# Altium project BS.PrjPCB
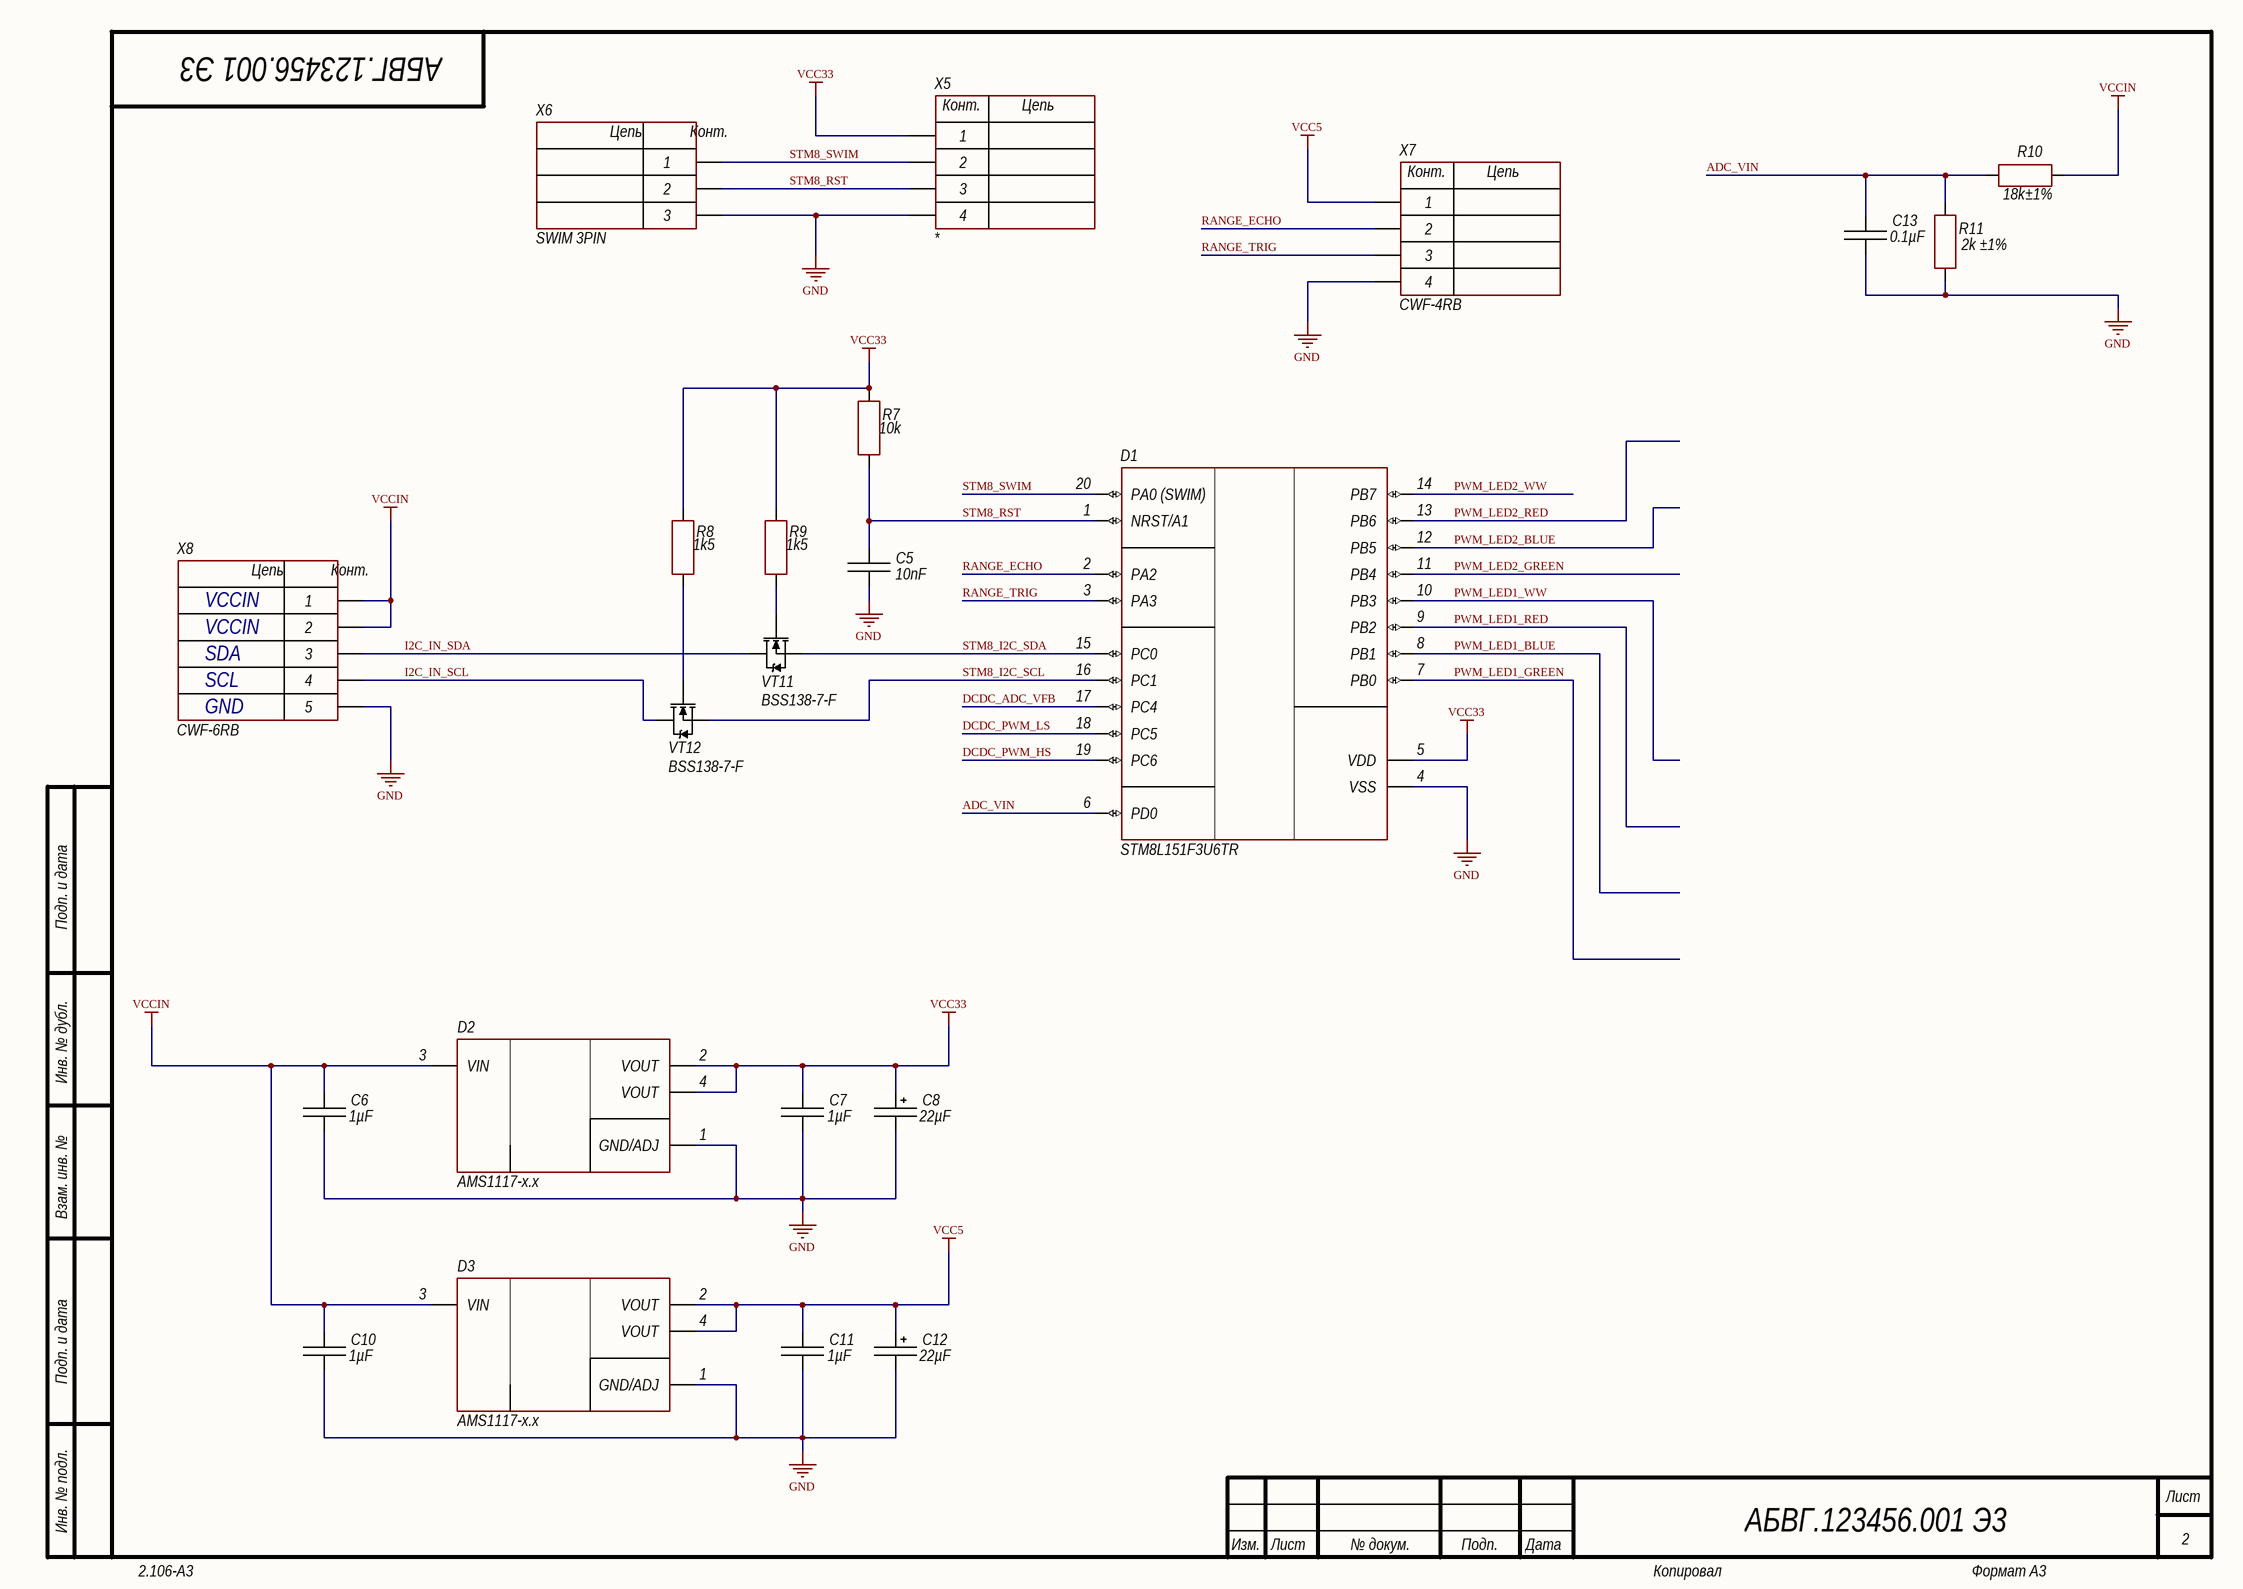
[diagram p0: MCU.SchDoc]
3 sheets, 57 parts. Net scope: global (net labels, ports and power ports of the same name join across sheets).
Board file: PCB.PcbDoc
Sheets:
  MCU.SchDoc
  DC unit.SchDoc
  LED Connection.SchDoc

## Sheet MCU.SchDoc
size 420 x 297 mm; Address1: Address1; Address2: Address2; Address3: Address3; Address4: Address4; DocumentNumber: АБВГ.123456.001 Э3; SheetNumber: 2; Scale: 1:1; DocumentType: Схема электрическая принципиальная; FirstReferrence: АБВГ.123456.001

### Parts
C5  10nF  [CH0603C]
C6  1µF  [CH0603C]
C7  1µF  [CH0603C]
C8  22µF  [TANTAL_B]
C10  1µF  [CH0603C]
C11  1µF  [CH0603C]
C12  22µF  [TANTAL_B]
C13  0.1µF  [CH0603C]
D1  STM8L151F3U6TR  [20-UFQFPN]
D2  AMS1117-x.x  [SOT223]
D3  AMS1117-x.x  [SOT223]
R7  10k  [CH0603R]
R8  1k5  [CH0603R]
R9  1k5  [CH0603R]
R10  18k  ComponentKind: ±1%  [CH0603R]
R11  2k  ComponentKind: ±1%  [CH0603R]
VT11  BSS138-7-F  [SOT23_132]
VT12  BSS138-7-F  [SOT23_132]
X5  *  [CON: CWF-4RB]
X6  SWIM 3PIN  [CON: 3 PIN 1x1]
X7  CWF-4RB  [CON: CWF-4RB]
X8  CWF-6RB  [CON: CWF-5RB]

### Nets
GND: C5.1 C6.1 C7.1 C8.2 C10.1 C11.1 C12.2 C13.2 D1.4(VSS) D2.1(GND/ADJ) D3.1(GND/ADJ) R11.1 X5.4 X6.3 X7.4 X8.5
VCC5: C11.2 C12.1 D3.2(VOUT) D3.4(VOUT) X7.1
VCC33: C7.2 C8.1 D1.5(VDD) D2.2(VOUT) D2.4(VOUT) R7.2 R8.2 R9.2 X5.1
VCCIN: C6.2 C10.2 D2.3(VIN) D3.3(VIN) R10.2 X8.1 X8.2
ADC_VIN: C13.1 D1.6(PD0) R10.1 R11.2
DCDC_ADC_VFB: D1.17(PC4)
DCDC_PWM_HS: D1.19(PC6)
DCDC_PWM_LS: D1.18(PC5)
I2C_IN_SCL: VT12.2(D) X8.4
I2C_IN_SDA: VT11.2(D) X8.3
PWM_LED1_BLUE: D1.8(PB1)
PWM_LED1_GREEN: D1.7(PB0)
PWM_LED1_RED: D1.9(PB2)
PWM_LED1_WW: D1.10(PB3)
PWM_LED2_BLUE: D1.12(PB5)
PWM_LED2_GREEN: D1.11(PB4)
PWM_LED2_RED: D1.13(PB6)
PWM_LED2_WW: D1.14(PB7)
RANGE_ECHO: D1.2(PA2) X7.2
RANGE_TRIG: D1.3(PA3) X7.3
STM8_I2C_SCL: D1.16(PC1) VT12.3(S)
STM8_I2C_SDA: D1.15(PC0) VT11.3(S)
STM8_RST: C5.2 D1.1(NRST/A1) R7.1 X5.3 X6.2
STM8_SWIM: D1.20(PA0_(SWIM)) X5.2 X6.1
NetR8_1: R8.1 VT12.1(G)
NetR9_1: R9.1 VT11.1(G)

### Notes on the sheet
- VCCIN
- SDA
- SCL
- GND
- Подп. и дата
- Инв. № дубл.
- Взам. инв. №
- Инв. № подл.
- Изм.
- Лист
- № докум.
- Подп.
- Дата
- 2.106-A3
- Копировал
- Формат А3
- (in symbol 3-Connector) Цепь; Конт.
- (in symbol 5-Connector) Цепь; Конт.

### Library data of the parts
C5 C13 = Capacitor: Manufacturer: *; Model: *; HelpURL: *; ComponentKind: *
  C5: Value: 10nF
  C13: Value: 0.1µF
C6 C7 C10 C11 = Capacitor: Manufacturer: Murata Electronics Inc.; Model: GRM188R71C105KE15D; HelpURL: https://www.terraelectronica.ru/product/2094261; ComponentKind: X5R; Value: 1µF
C8 C12 = TantalCap: Manufacturer: *; Model: *; HelpURL: *; ComponentKind: *; Value: 22µF
D1 = STM8L151F3U6TR: STM8; Manufacturer: ST Microelectronics; Model: STM8L151F3U6TR; ComponentKind: UFQFPN20; HelpURL: https://ru.mouser.com/ProductDetail/STMicroelectronics/STM8L151F3U6TR?qs=%2fha2pyFadujNatApb6mgzz%2fJ8pBCuKMdXUiFB4BdrxFB7btRjiLFjw%3d%3d
D2 D3 = AMS1117-x.x: Step-down; Manufacturer: Advanced Monolithic Systems; Model: AMS11117-X.X; HelpURL: http://www.advanced-monolithic.com/pdf/ds1117.pdf; ComponentKind: SOT-223
R7-R11 = Resistor: Manufacturer: *; Model: *; HelpURL: *
  R7: ComponentKind: *; Value: 10k
  R8 R9: ComponentKind: *; Value: 1k5
  R10: Value: 18k
  R11: Value: 2k
VT11 VT12 = N-chanel: Mosfet; Manufacturer: Diodes Incorporated; Model: BSS138-7-F; ComponentKind: 0.2А, 50В; HelpURL: https://static.chipdip.ru/lib/333/DOC003333982.pdf
X5 X7 = 4-Connector: Manufacturer: *; HelpURL: *; ComponentKind: *
  X5: Model: *
  X7: Model: CWF-4RB
X6 = 3-Connector: Model: SWIM 3PIN; Manufacturer: *; HelpURL: *; ComponentKind: *
X8 = 5-Connector: Model: CWF-6RB; Manufacturer: *; HelpURL: *; ComponentKind: *

## Sheet DC unit.SchDoc
size 420 x 297 mm; Address1: Address1; Address2: Address2; Address3: Address3; Address4: Address4; DocumentNumber: АБВГ.123456.001 Э3; SheetNumber: 2; Scale: 1:1; DocumentType: Схема электрическая принципиальная; FirstReferrence: АБВГ.123456.001
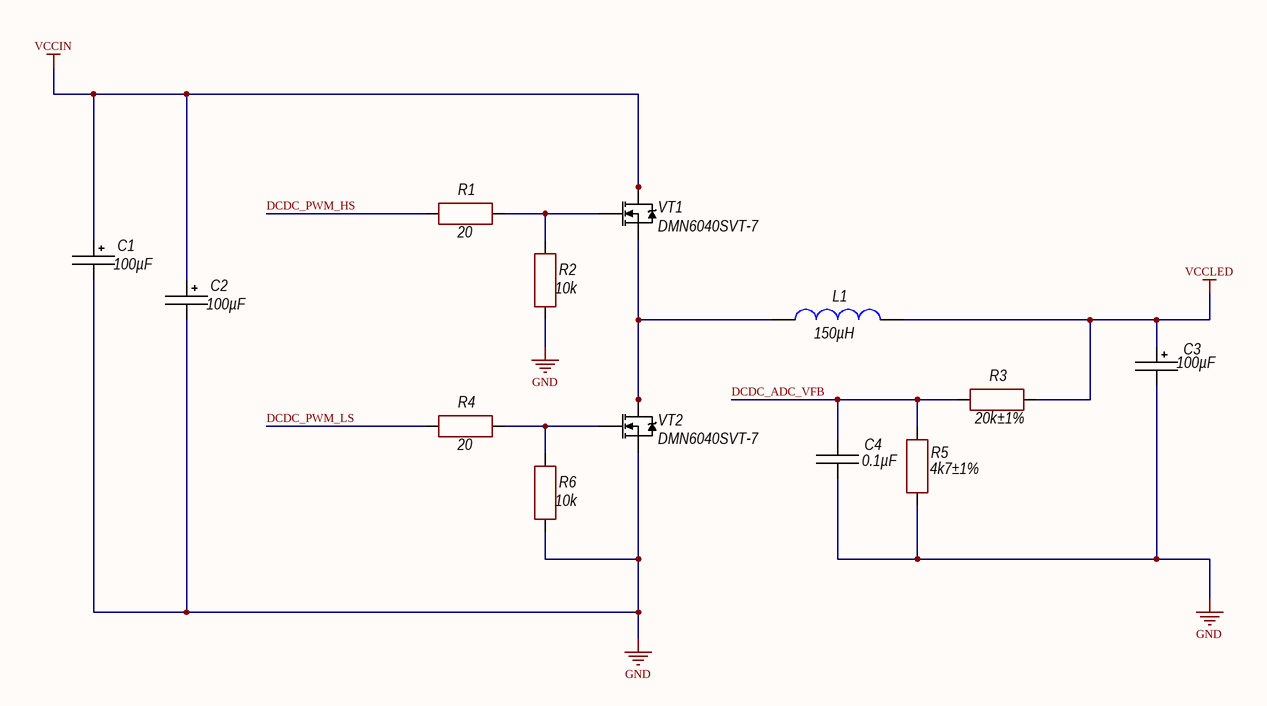
[diagram p1: DC unit.SchDoc]

### Parts
C1  100µF  [D8C3.2H12]
C2  100µF  [D8C3.2H12]
C3  100µF  [TANTAL_D]
C4  0.1µF  [CH0603C]
L1  150µH  [IND: CDRH127]
R1  20  [CH0603R]
R2  10k  [CH0603R]
R3  20k  ComponentKind: ±1%  [CH0603R]
R4  20  [CH0603R]
R5  4k7  ComponentKind: ±1%  [CH0603R]
R6  10k  [CH0603R]
VT1  DMN6040SVT-7  [TSOT23-6]
VT2  DMN6040SVT-7  [TSOT23-6]

### Nets
GND: C1.2 C2.2 C3.2 C4.2 R2.1 R5.1 R6.1 VT2.4(S)
VCCIN: C1.1 C2.1 VT1.1(D) VT1.2(D) VT1.5(D) VT1.6(D)
VCCLED: C3.1 L1.1 R3.2
DCDC_ADC_VFB: C4.1 R3.1 R5.2
DCDC_PWM_HS: R1.1
DCDC_PWM_LS: R4.1
NetL1_2: L1.2 VT1.4(S) VT2.1(D) VT2.2(D) VT2.5(D) VT2.6(D)
NetR1_2: R1.2 R2.2 VT1.3(G)
NetR4_2: R4.2 R6.2 VT2.3(G)

### Notes on the sheet
- Подп. и дата
- Инв. № дубл.
- Взам. инв. №
- Инв. № подл.
- Изм.
- Лист
- № докум.
- Подп.
- Дата
- 2.106-A3
- Копировал
- Формат А3

### Library data of the parts
C1 C2 = AlumCap: Manufacturer: *; Model: *; HelpURL: *; ComponentKind: *; Value: 100µF
C3 = TantalCap: Manufacturer: Vishay Intertechnology Inc.; Model: TPSD107K020R0085; HelpURL: https://www.terraelectronica.ru/product/579425; ComponentKind: 20V; Value: 100µF
C4 = Capacitor: Manufacturer: *; Model: *; HelpURL: *; ComponentKind: *; Value: 0.1µF
L1 = Inductor: Manufacturer: Sumida Electric; Model: CDRH127/LDNP-390MC; HelpURL: https://www.terraelectronica.ru/product/231334; ComponentKind: 3.5А; Value: 150µH
R1-R6 = Resistor: Manufacturer: *; Model: *; HelpURL: *
  R1 R4: ComponentKind: *; Value: 20
  R2 R6: ComponentKind: *; Value: 10k
  R3: Value: 20k
  R5: Value: 4k7
VT1 VT2 = DMN6040SVT-7: Mosfet; Manufacturer: Diodes Incorporated; Model: DMN6040SVT-7; ComponentKind: 60V 5A; HelpURL: https://www.diodes.com/assets/Datasheets/DMN6040SVT.pdf

## Sheet LED Connection.SchDoc
size 420 x 297 mm; Address1: Address1; Address2: Address2; Address3: Address3; Address4: Address4; DocumentNumber: АБВГ.123456.001 Э3; SheetNumber: 2; Scale: 1:1; DocumentType: Схема электрическая принципиальная; FirstReferrence: АБВГ.123456.001
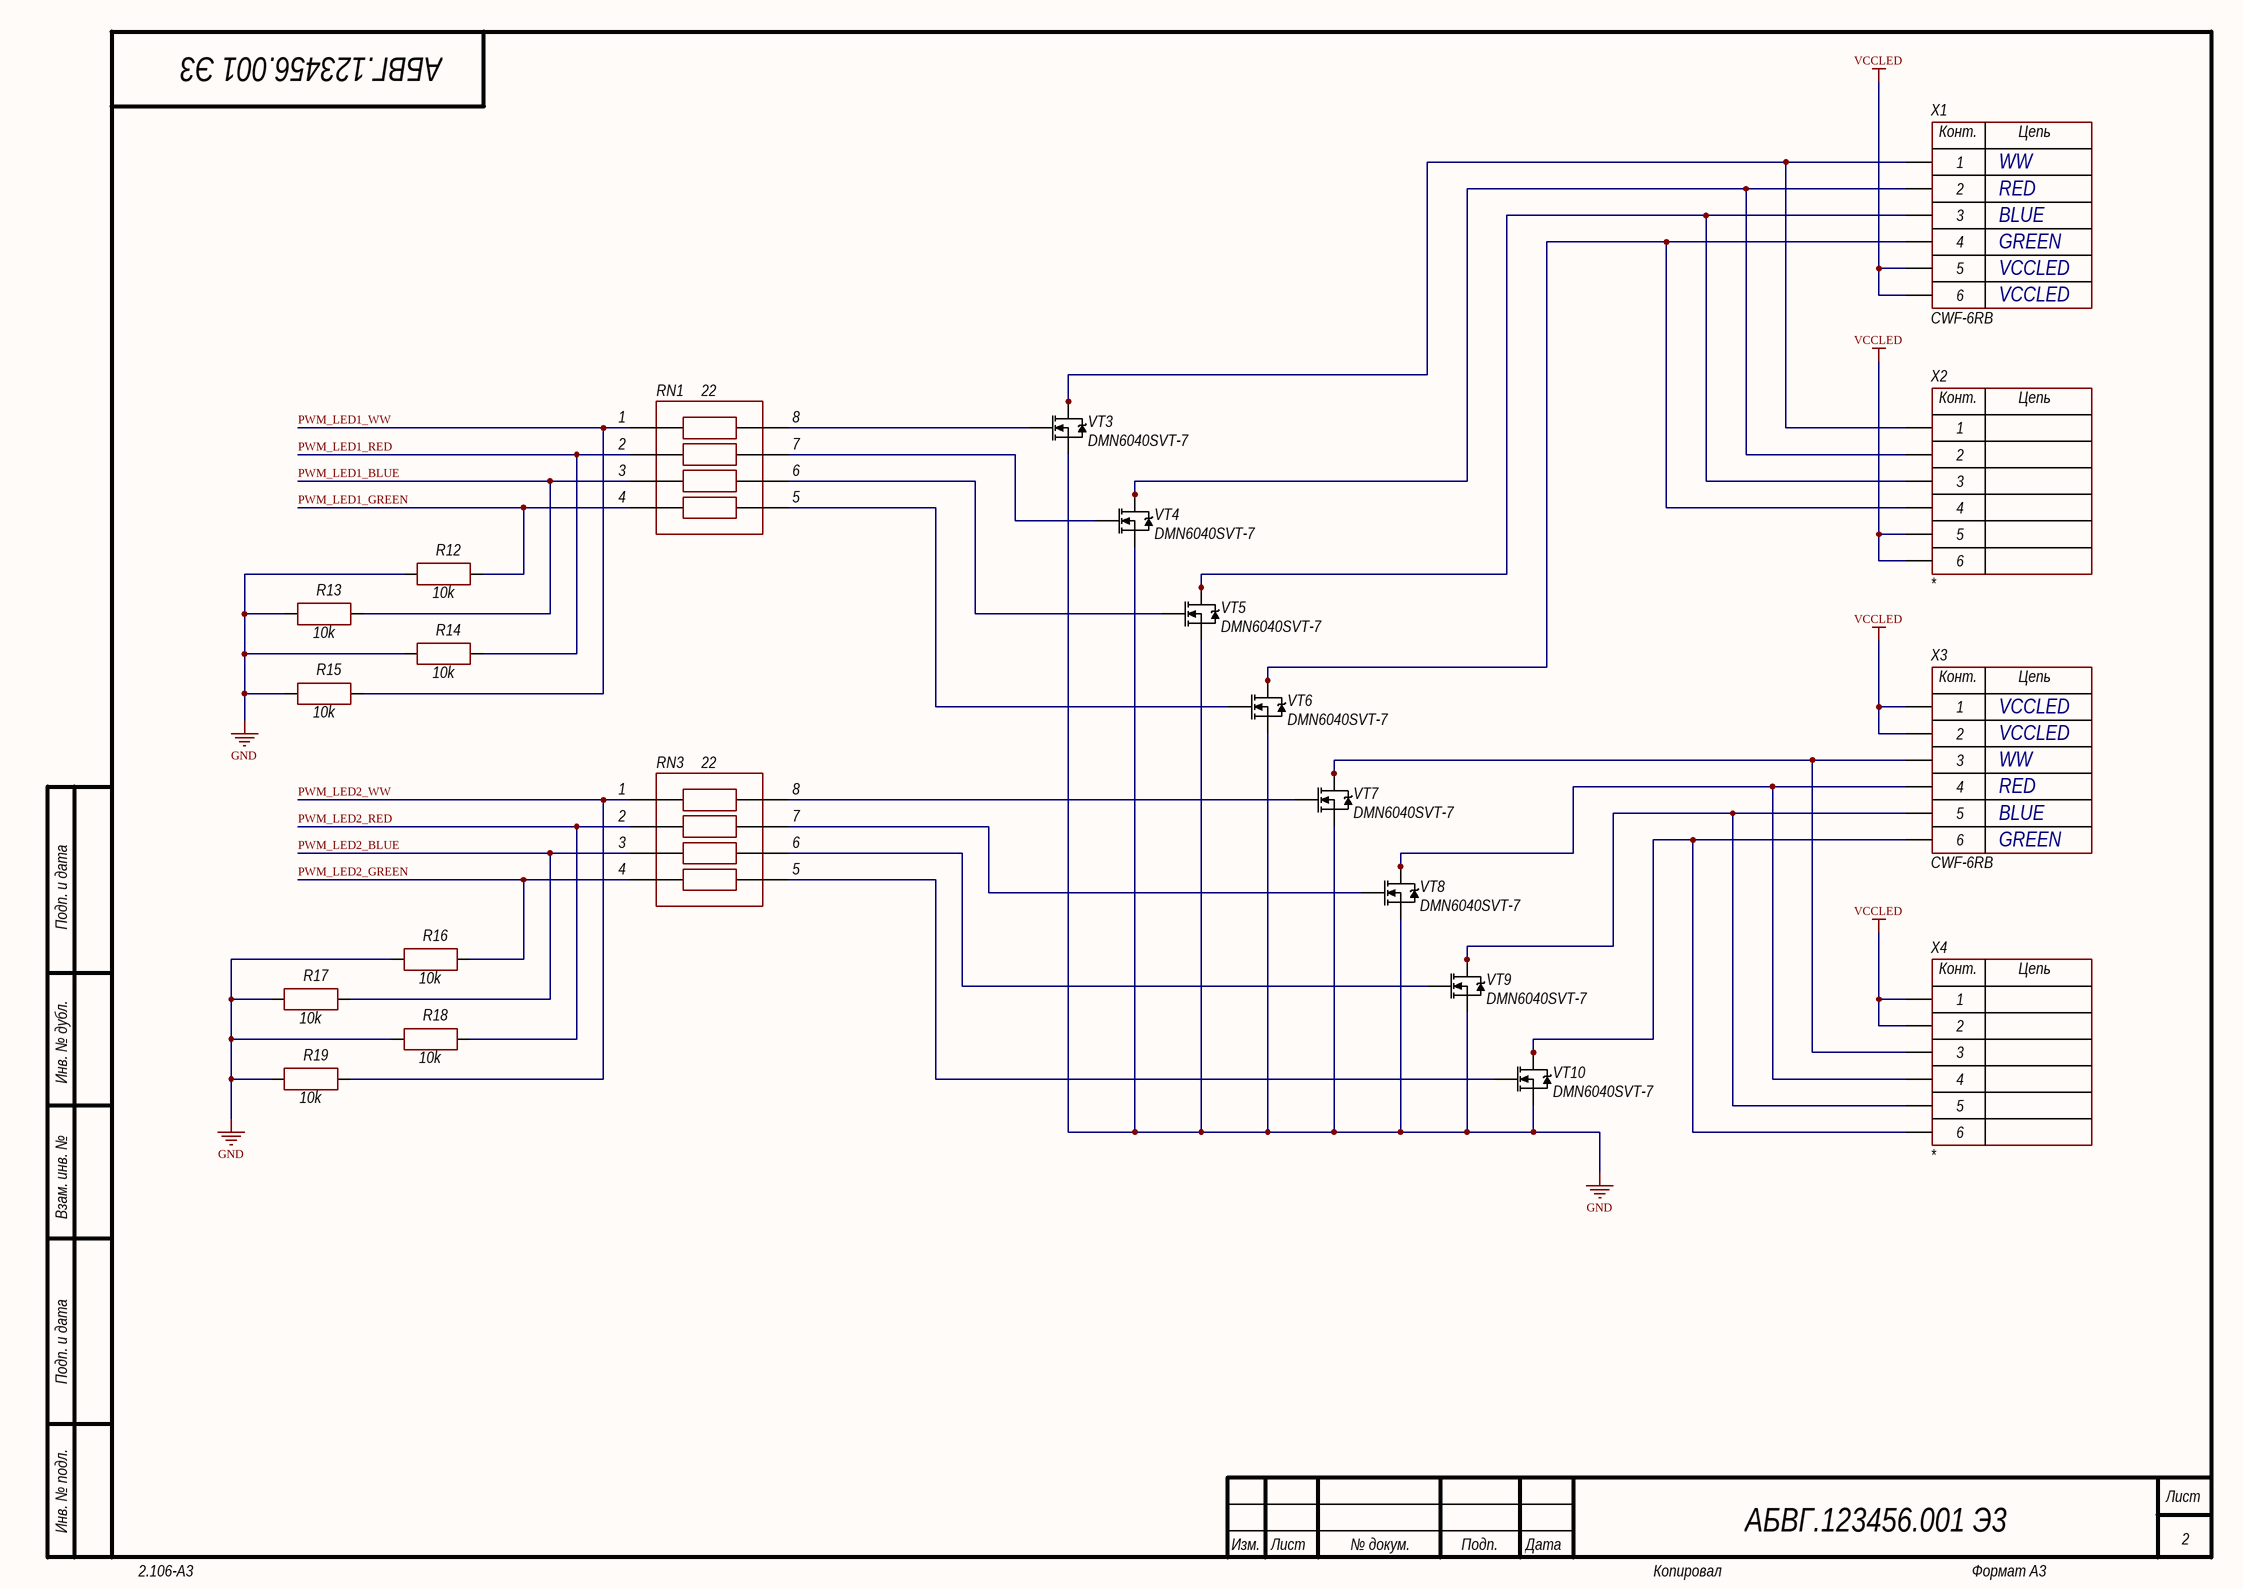
[diagram p2: LED Connection.SchDoc]

### Parts
R12  10k  [CH0603R]
R13  10k  [CH0603R]
R14  10k  [CH0603R]
R15  10k  [CH0603R]
R16  10k  [CH0603R]
R17  10k  [CH0603R]
R18  10k  [CH0603R]
R19  10k  [CH0603R]
RN1  22  [CH0603Rx4 (1206)]
RN3  22  [CH0603Rx4 (1206)]
VT3  DMN6040SVT-7  [TSOT23-6]
VT4  DMN6040SVT-7  [TSOT23-6]
VT5  DMN6040SVT-7  [TSOT23-6]
VT6  DMN6040SVT-7  [TSOT23-6]
VT7  DMN6040SVT-7  [TSOT23-6]
VT8  DMN6040SVT-7  [TSOT23-6]
VT9  DMN6040SVT-7  [TSOT23-6]
VT10  DMN6040SVT-7  [TSOT23-6]
X1  CWF-6RB  [CON: CWF-6RB]
X2  *  [CON: PBS-6]
X3  CWF-6RB  [CON: CWF-6RB]
X4  *  [CON: PBS-6]

### Nets
GND: R12.1 R13.1 R14.1 R15.1 R16.1 R17.1 R18.1 R19.1 VT3.4(S) VT4.4(S) VT5.4(S) VT6.4(S) VT7.4(S) VT8.4(S) VT9.4(S) VT10.4(S)
VCCLED: X1.5 X1.6 X2.5 X2.6 X3.1 X3.2 X4.1 X4.2
PWM_LED1_BLUE: R13.2 RN1.3
PWM_LED1_GREEN: R12.2 RN1.4
PWM_LED1_RED: R14.2 RN1.2
PWM_LED1_WW: R15.2 RN1.1
PWM_LED2_BLUE: R17.2 RN3.3
PWM_LED2_GREEN: R16.2 RN3.4
PWM_LED2_RED: R18.2 RN3.2
PWM_LED2_WW: R19.2 RN3.1
NetRN1_5: RN1.5 VT6.3(G)
NetRN1_6: RN1.6 VT5.3(G)
NetRN1_7: RN1.7 VT4.3(G)
NetRN1_8: RN1.8 VT3.3(G)
NetRN3_5: RN3.5 VT10.3(G)
NetRN3_6: RN3.6 VT9.3(G)
NetRN3_7: RN3.7 VT8.3(G)
NetRN3_8: RN3.8 VT7.3(G)
NetVT3_1: VT3.1(D) VT3.2(D) VT3.5(D) VT3.6(D) X1.1 X2.1
NetVT4_1: VT4.1(D) VT4.2(D) VT4.5(D) VT4.6(D) X1.2 X2.2
NetVT5_1: VT5.1(D) VT5.2(D) VT5.5(D) VT5.6(D) X1.3 X2.3
NetVT6_1: VT6.1(D) VT6.2(D) VT6.5(D) VT6.6(D) X1.4 X2.4
NetVT7_1: VT7.1(D) VT7.2(D) VT7.5(D) VT7.6(D) X3.3 X4.3
NetVT8_1: VT8.1(D) VT8.2(D) VT8.5(D) VT8.6(D) X3.4 X4.4
NetVT9_1: VT9.1(D) VT9.2(D) VT9.5(D) VT9.6(D) X3.5 X4.5
NetVT10_1: VT10.1(D) VT10.2(D) VT10.5(D) VT10.6(D) X3.6 X4.6

### Notes on the sheet
- WW
- RED
- BLUE
- GREEN
- VCCLED
- Подп. и дата
- Инв. № дубл.
- Взам. инв. №
- Инв. № подл.
- Изм.
- Лист
- № докум.
- Подп.
- Дата
- 2.106-A3
- Копировал
- Формат А3
- (in symbol 6-Connector) Конт.; Цепь

### Library data of the parts
R12-R19 = Resistor: Manufacturer: *; Model: *; HelpURL: *; ComponentKind: *; Value: 10k
RN1 RN3 = Resistor assembly: Manufacturer: Bourns GmbH.; Model: CAT16-J4; HelpURL: https://www.terraelectronica.ru/pdf/show?pdf_file=https%253A%252F%252Fwww.mouser.com%252Fds%252F2%252F54%252FATCAY-777361.pdf; ComponentKind: *; Value: 22
VT3-VT10 = DMN6040SVT-7: as VT1 on sheet DC unit; Model: DMN6040SVT-7; ComponentKind: 60V 5A; HelpURL: https://www.diodes.com/assets/Datasheets/DMN6040SVT.pdf
X1-X4 = 6-Connector: Manufacturer: *; HelpURL: *; ComponentKind: *
  X1 X3: Model: CWF-6RB
  X2 X4: Model: *

## Nets that join several sheets
GND: MCU (16 pins), DC unit (8 pins), LED Connection (16 pins)
VCCIN: MCU (7 pins), DC unit (6 pins)
VCCLED: DC unit (C3.1 L1.1 R3.2), LED Connection (8 pins)
DCDC_ADC_VFB: MCU (D1.17), DC unit (C4.1 R3.1 R5.2)
DCDC_PWM_HS: MCU (D1.19), DC unit (R1.1)
DCDC_PWM_LS: MCU (D1.18), DC unit (R4.1)
PWM_LED1_BLUE: MCU (D1.8), LED Connection (R13.2 RN1.3)
PWM_LED1_GREEN: MCU (D1.7), LED Connection (R12.2 RN1.4)
PWM_LED1_RED: MCU (D1.9), LED Connection (R14.2 RN1.2)
PWM_LED1_WW: MCU (D1.10), LED Connection (R15.2 RN1.1)
PWM_LED2_BLUE: MCU (D1.12), LED Connection (R17.2 RN3.3)
PWM_LED2_GREEN: MCU (D1.11), LED Connection (R16.2 RN3.4)
PWM_LED2_RED: MCU (D1.13), LED Connection (R18.2 RN3.2)
PWM_LED2_WW: MCU (D1.14), LED Connection (R19.2 RN3.1)